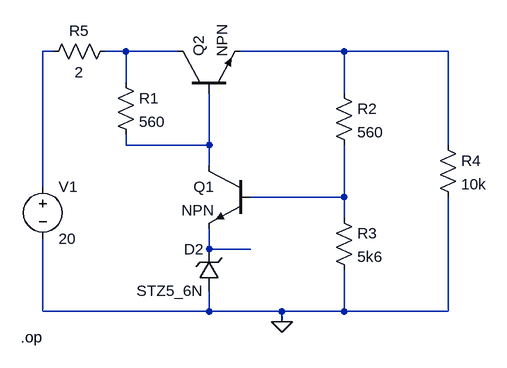
[diagram p0: schematic problema5.asc]
problema5.asc, the LTspice schematic file:
Version 4
SHEET 1 880 680
WIRE 32 -112 16 -112
WIRE 144 -112 112 -112
WIRE 224 -112 144 -112
WIRE 480 -112 320 -112
WIRE 640 -112 480 -112
WIRE 144 -64 144 -112
WIRE 480 -48 480 -112
WIRE 144 32 144 16
WIRE 272 32 272 -48
WIRE 272 32 144 32
WIRE 640 32 640 -112
WIRE 272 64 272 32
WIRE 16 96 16 -112
WIRE 480 112 480 32
WIRE 480 112 336 112
WIRE 480 144 480 112
WIRE 272 192 272 160
WIRE 336 192 272 192
WIRE 16 288 16 176
WIRE 272 288 272 256
WIRE 272 288 16 288
WIRE 384 288 272 288
WIRE 480 288 480 224
WIRE 480 288 384 288
WIRE 640 288 640 112
WIRE 640 288 480 288
WIRE 384 304 384 288
FLAG 384 304 0
DATAFLAG 624 -112 ""
DATAFLAG 448 112 ""
DATAFLAG 272 176 ""
DATAFLAG 272 192 ""
DATAFLAG 272 192 ""
DATAFLAG 272 176 ""
DATAFLAG 272 176 ""
DATAFLAG 272 176 ""
DATAFLAG 272 176 ""
DATAFLAG 272 176 ""
DATAFLAG 272 176 ""
DATAFLAG 272 176 ""
DATAFLAG 272 176 ""
DATAFLAG 272 176 ""
DATAFLAG 272 176 ""
DATAFLAG 272 176 ""
DATAFLAG 272 -32 ""
DATAFLAG 144 -112 ""
SYMBOL zener 288 256 R180
WINDOW 0 24 64 Left 2
WINDOW 3 24 0 Left 2
SYMATTR InstName D2
SYMATTR Value STZ5_6N
SYMBOL npn 336 64 M0
SYMATTR InstName Q1
SYMBOL res 128 -80 R0
SYMATTR InstName R1
SYMATTR Value 560
SYMBOL npn 224 -48 R270
SYMATTR InstName Q2
SYMBOL res 464 -64 R0
SYMATTR InstName R2
SYMATTR Value 560
SYMBOL res 464 128 R0
SYMATTR InstName R3
SYMATTR Value 5k6
SYMBOL res 624 16 R0
SYMATTR InstName R4
SYMATTR Value 10k
SYMBOL voltage 16 80 R0
SYMATTR InstName V1
SYMATTR Value 20
SYMBOL res 128 -128 R90
WINDOW 0 0 56 VBottom 2
WINDOW 3 32 56 VTop 2
SYMATTR InstName R5
SYMATTR Value 2
TEXT -18 328 Left 2 !.op

The netlist it stands for:
* problema5.asc
D2 0 N006 STZ5_6N
Q1 N004 N005 N006 0 NPN
R1 N002 N004 560
Q2 N002 N004 N003 0 NPN
R2 N003 N005 560
R3 N005 0 5k6
R4 N003 0 10k
V1 N001 0 20
R5 N002 N001 2
.model D D
.lib standard.dio
.model NPN NPN
.model PNP PNP
.lib standard.bjt
.op
.backanno
.end